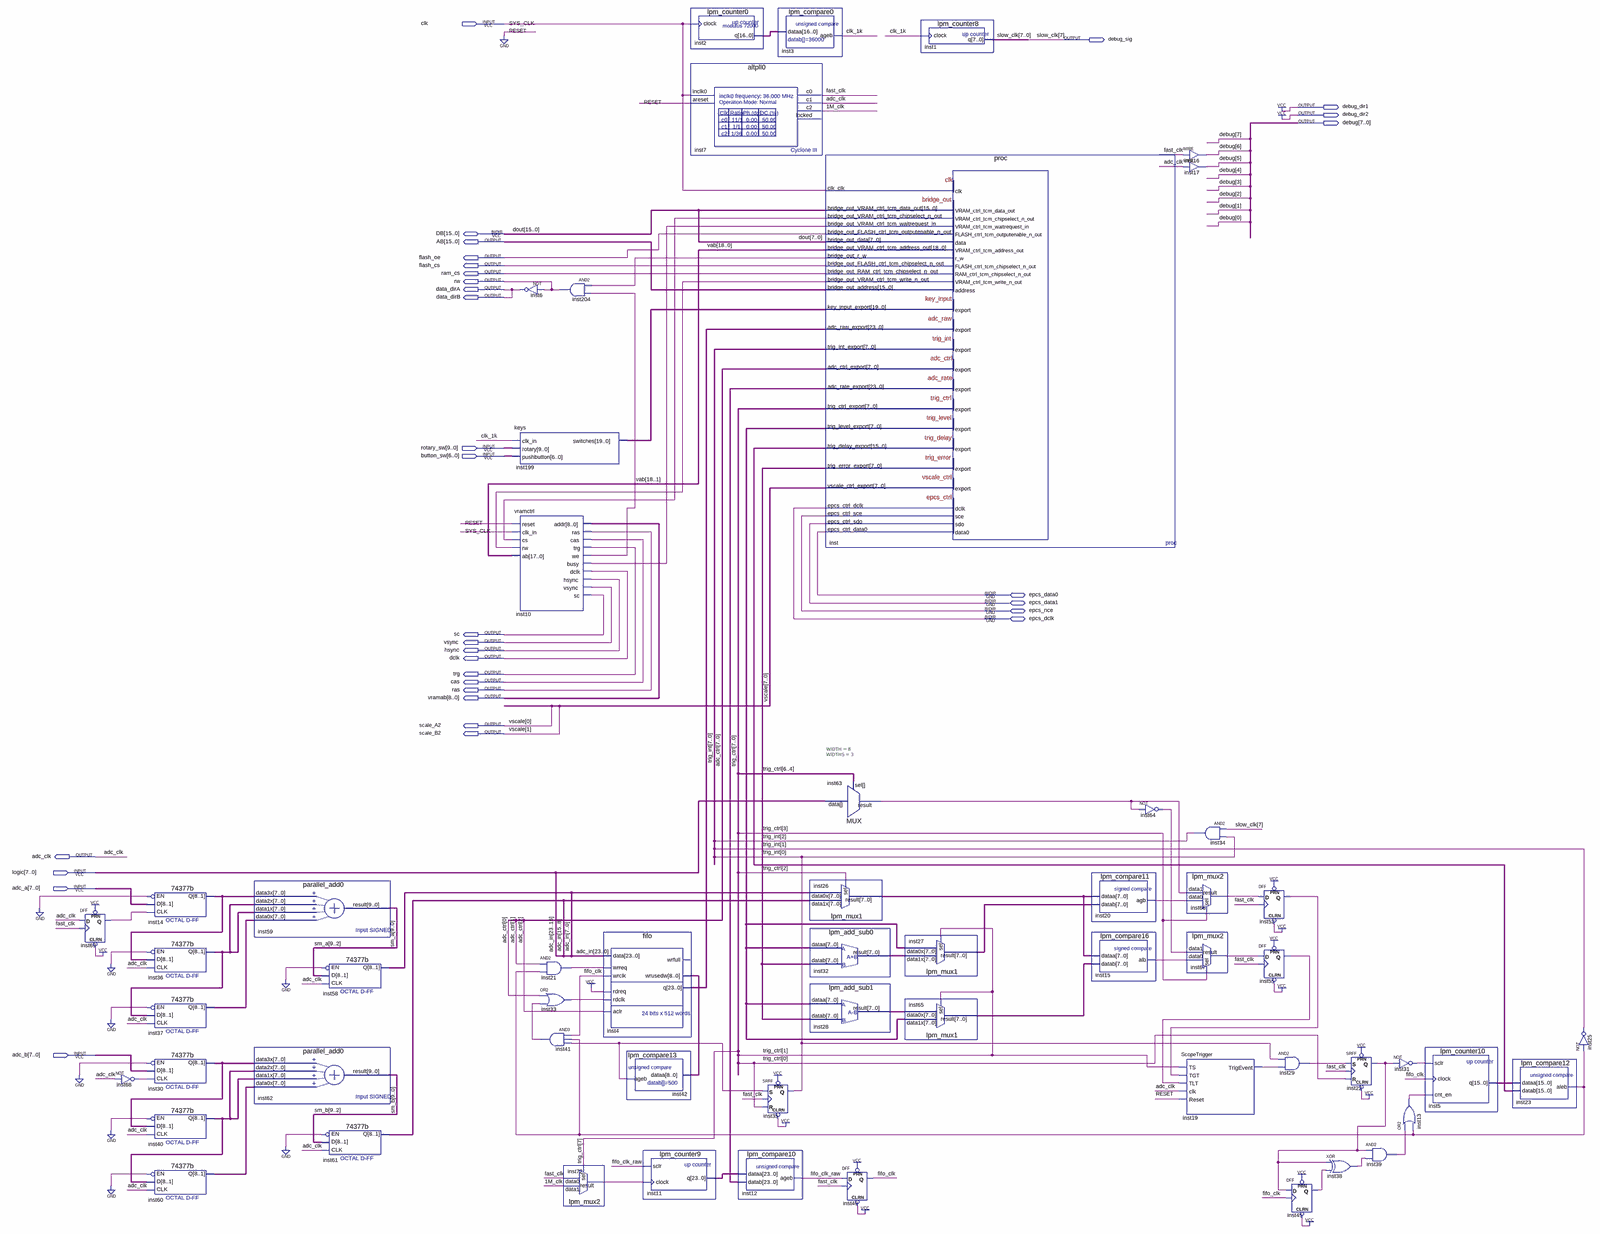
[diagram p0: schematic sheet, whole]
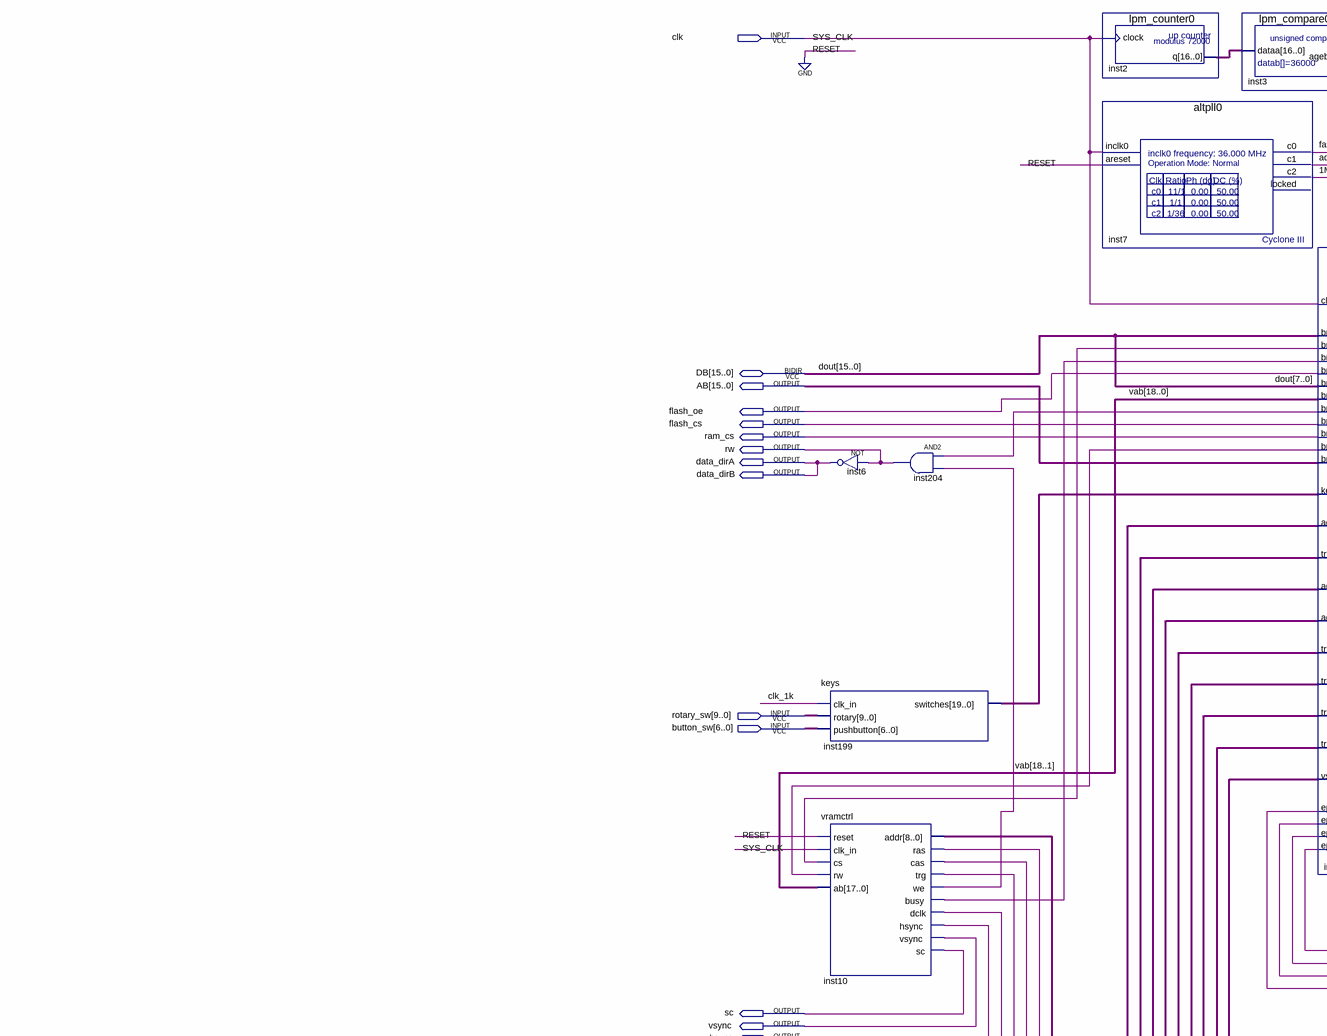
[diagram p1: schematic sheet, upper left part]
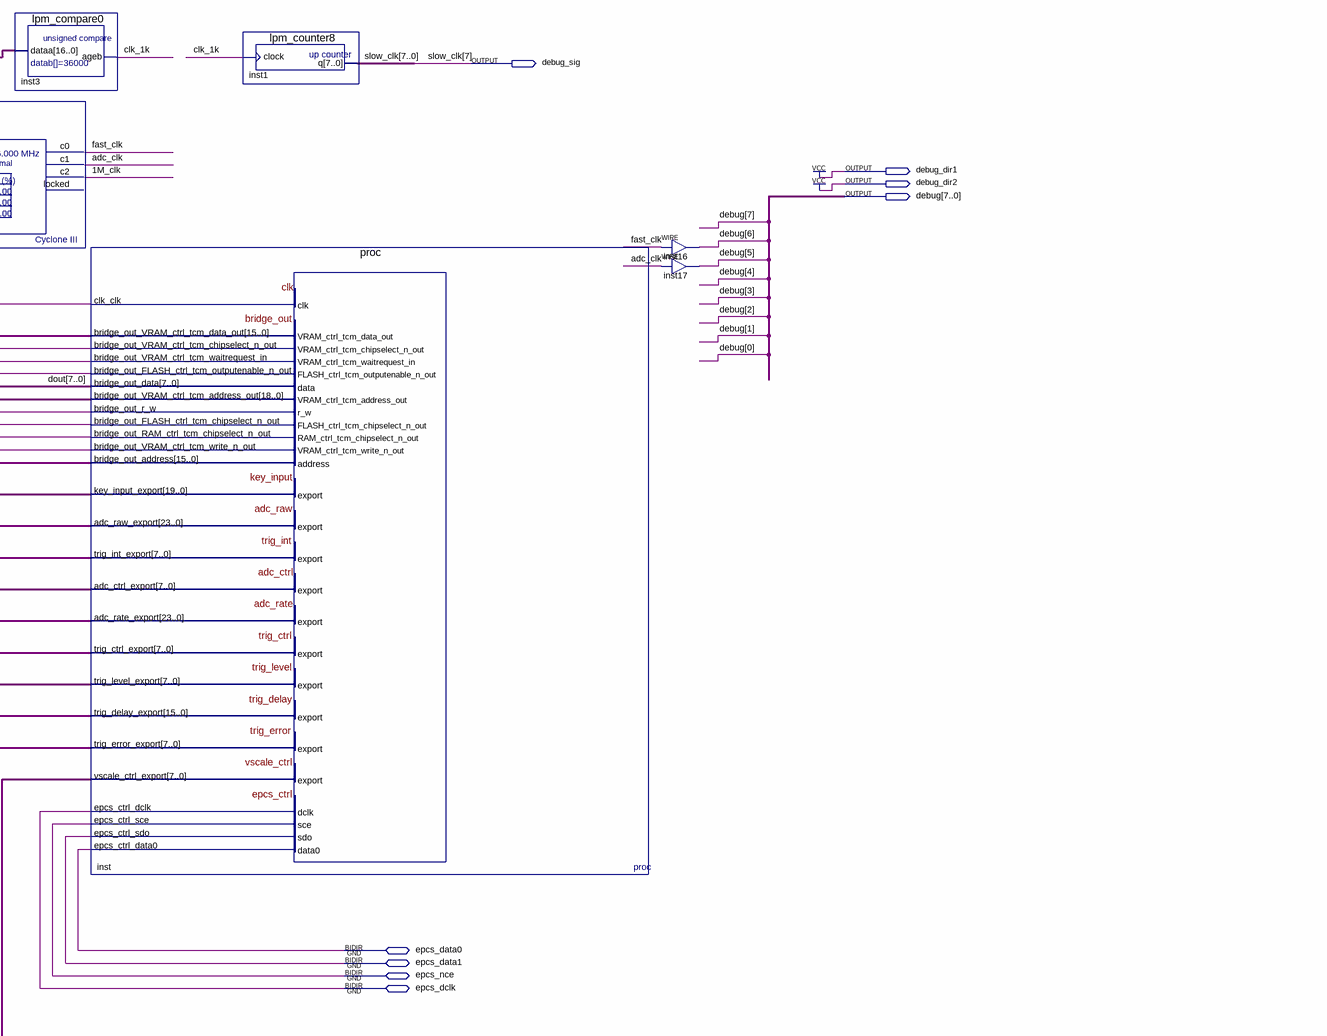
[diagram p2: schematic sheet, upper right part]
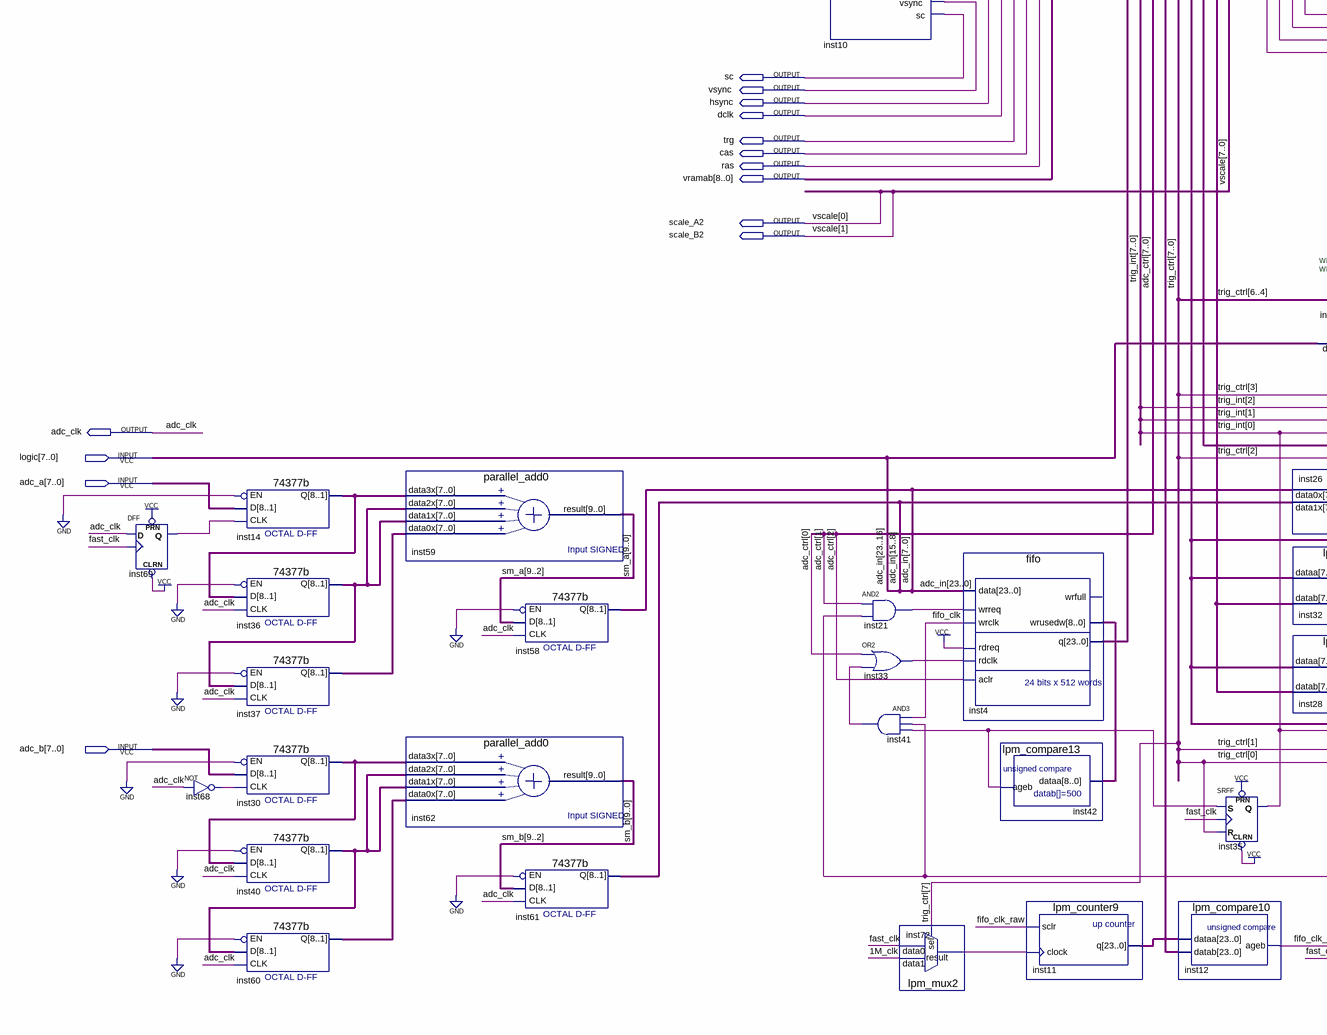
[diagram p3: schematic sheet, lower left part]
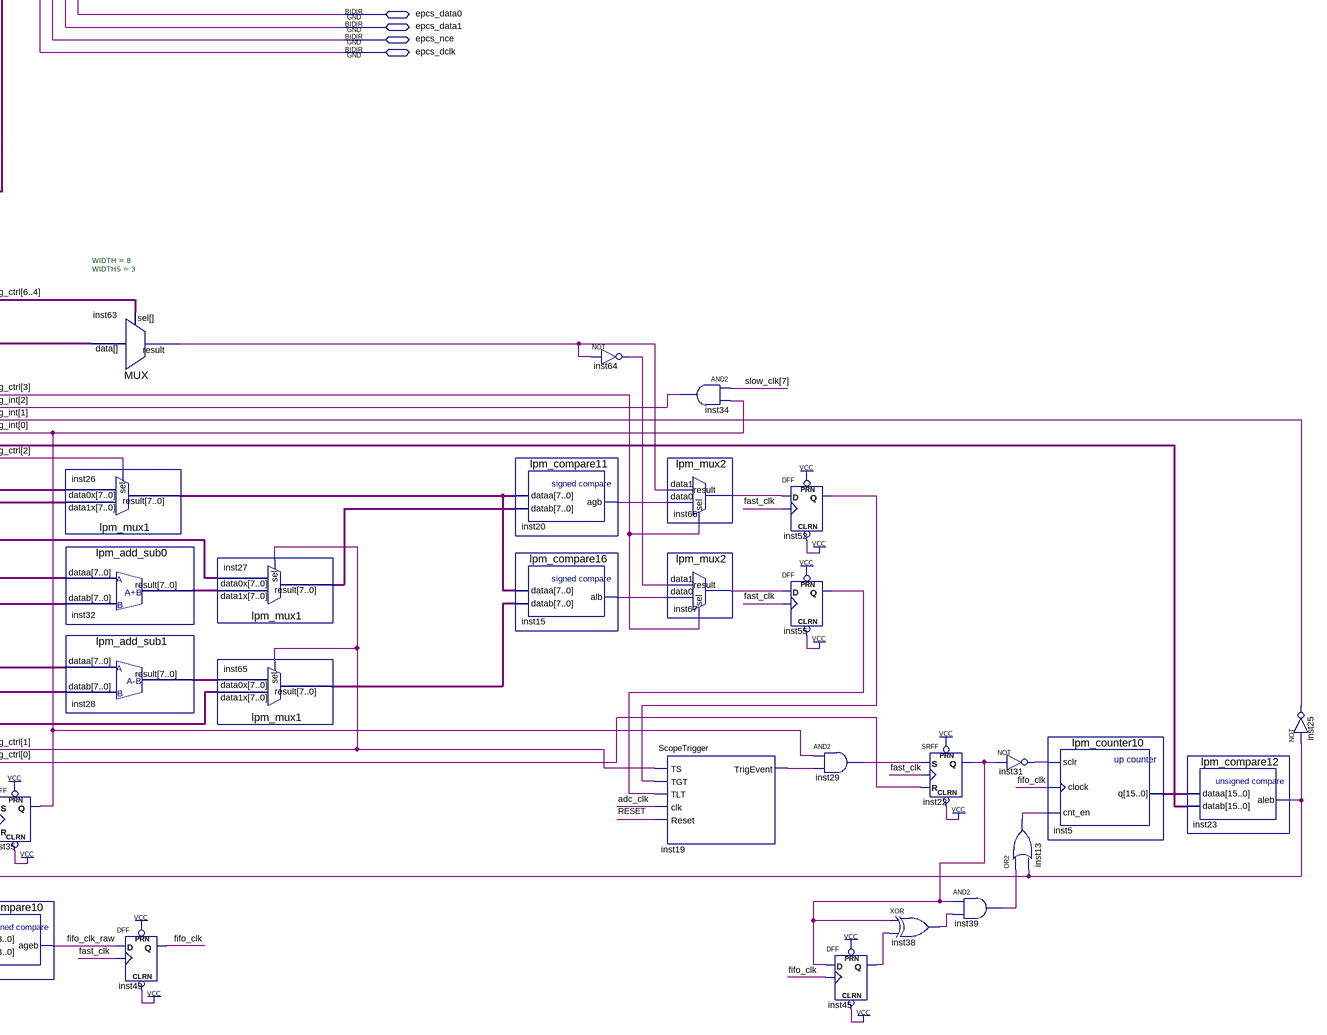
[diagram p4: schematic sheet, lower right part]
// Quartus schematic osc.bdf as structural Verilog: 58 symbols, 33 pins
module osc (
  input  clk,
  input  [9:0] rotary_sw,
  input  [6:0] button_sw,
  input  [7:0] \logic ,
  input  [7:0] adc_a,
  input  [7:0] adc_b,
  inout  [15:0] DB,
  inout  epcs_data0,
  inout  epcs_data1,
  inout  epcs_nce,
  inout  epcs_dclk,
  output debug_sig,
  output debug_dir1,
  output debug_dir2,
  output [7:0] debug,
  output [15:0] AB,
  output flash_oe,
  output flash_cs,
  output ram_cs,
  output rw,
  output data_dirA,
  output data_dirB,
  output sc,
  output vsync,
  output hsync,
  output dclk,
  output trg,
  output cas,
  output ras,
  output [8:0] vramab,
  output scale_A2,
  output scale_B2,
  output adc_clk
);

  wire \1M_clk , clk_1k, fast_clk, fifo_clk, fifo_clk_raw, inst10_busy, inst10_we, inst13_out, inst15_alb,
       inst19_trigevent, inst20_agb, inst21_out, inst22_q, inst23_aleb, inst29_out, inst31_out, inst33_out,
       inst38_out, inst39_out, inst41_out, inst42_ageb, inst45_q, inst52_q, inst55_q, inst63_result,
       inst64_out, inst66_result, inst67_result, inst68_out, inst69_q, inst72_result, inst_bridge_out_r_w,
       inst_bridge_out_vram_ctrl_tcm_chipselect_n_out, inst_bridge_out_vram_ctrl_tcm_write_n_out;
  wire [6:0] slow_clk;
  wire [7:0] adc_ctrl, inst14_q, inst26_result, inst27_result, inst28_result, inst30_q, inst32_result,
       inst36_q, inst37_q, inst40_q, inst60_q, inst65_result, inst_trig_error_export, inst_trig_level_export,
       trig_ctrl, trig_int;
  wire [7:2] vscale;
  wire [8:0] inst4_wrusedw;
  wire [9:0] sm_a, sm_b;
  wire [15:0] adc_in, inst5_q, inst_trig_delay_export;
  wire [16:0] inst2_q;
  wire [18:0] vab;
  wire [19:0] inst199_switches;
  wire [23:0] inst4_q, inst11_q, inst_adc_rate_export;

  DFF inst69 (.CLRN(1'b1), .CLK(fast_clk), .D(adc_clk), .PRN(1'b1), .Q(inst69_q));
  not inst68 (inst68_out, adc_clk);
  \74377b  inst14 (.CLK(inst69_q), .EN(1'b0), .D(adc_a), .Q(inst14_q));
  \74377b  inst36 (.CLK(adc_clk), .EN(1'b0), .D(inst14_q), .Q(inst36_q));
  \74377b  inst37 (.CLK(adc_clk), .EN(1'b0), .D(inst36_q), .Q(inst37_q));
  \74377b  inst30 (.CLK(inst68_out), .EN(1'b0), .D(adc_b), .Q(inst30_q));
  \74377b  inst40 (.CLK(adc_clk), .EN(1'b0), .D(inst30_q), .Q(inst40_q));
  \74377b  inst60 (.CLK(adc_clk), .EN(1'b0), .D(inst40_q), .Q(inst60_q));
  parallel_add0 inst59 (.data3x(inst14_q), .data2x(inst36_q), .data1x(inst36_q), .data0x(inst37_q), .result(sm_a));
  parallel_add0 inst62 (.data3x(inst30_q), .data2x(inst40_q), .data1x(inst40_q), .data0x(inst60_q), .result(sm_b));
  \74377b  inst58 (.CLK(adc_clk), .EN(1'b0), .D(sm_a[9:2]), .Q(adc_in[7:0]));
  \74377b  inst61 (.CLK(adc_clk), .EN(1'b0), .D(sm_b[9:2]), .Q(adc_in[15:8]));
  keys inst199 (.clk_in(clk_1k), .rotary(rotary_sw), .pushbutton(button_sw), .switches(inst199_switches));
  vramctrl inst10 (
    .reset(1'b0), .clk_in(clk), .cs(inst_bridge_out_vram_ctrl_tcm_chipselect_n_out),
    .rw(inst_bridge_out_vram_ctrl_tcm_write_n_out), .ab(vab[18:1]), .addr(vramab), .ras(ras), .cas(cas),
    .trg(trg), .we(inst10_we), .busy(inst10_busy), .dclk(dclk), .hsync(hsync), .vsync(vsync), .sc(sc));
  not inst6 (data_dirA, rw);
  and inst21 (inst21_out, adc_ctrl[1], inst23_aleb);
  or inst33 (inst33_out, adc_ctrl[0], inst41_out);
  and inst41 (inst41_out, fifo_clk, inst23_aleb, inst42_ageb);
  and inst204 (rw, inst_bridge_out_r_w, inst10_we);
  lpm_mux2 inst72 (.data1(\1M_clk ), .data0(fast_clk), .sel(trig_ctrl[7]), .result(inst72_result));
  fifo inst4 (
    .data({\logic , adc_in}), .wrreq(inst21_out), .wrclk(fifo_clk), .rdreq(1'b1), .rdclk(inst33_out),
    .aclr(adc_ctrl[2]), .wrusedw(inst4_wrusedw), .q(inst4_q));  // open: wrfull
  lpm_compare13 inst42 (.dataa(inst4_wrusedw), .ageb(inst42_ageb));
  lpm_counter9 inst11 (.sclr(fifo_clk_raw), .clock(inst72_result), .q(inst11_q));
  lpm_counter0 inst2 (.clock(clk), .q(inst2_q));
  altpll0 inst7 (.inclk0(clk), .areset(1'b0), .c0(fast_clk), .c1(adc_clk), .c2(\1M_clk ));  // open: locked
  lpm_compare10 inst12 (.dataa(inst11_q), .datab(inst_adc_rate_export), .ageb(fifo_clk_raw));
  SRFF inst35 (.PRN(1'b1), .CLRN(1'b1), .S(inst42_ageb), .R(trig_ctrl[0]), .CLK(fast_clk), .Q(trig_int[0]));
  lpm_compare0 inst3 (.dataa(inst2_q), .ageb(clk_1k));
  proc inst (
    .clk_clk(clk), .bridge_out_VRAM_ctrl_tcm_waitrequest_in(inst10_busy),
    .key_input_export(inst199_switches), .adc_raw_export(inst4_q), .trig_int_export(trig_int),
    .epcs_ctrl_data0(epcs_data0),
    .bridge_out_VRAM_ctrl_tcm_chipselect_n_out(inst_bridge_out_vram_ctrl_tcm_chipselect_n_out),
    .bridge_out_FLASH_ctrl_tcm_outputenable_n_out(flash_oe), .bridge_out_VRAM_ctrl_tcm_address_out(vab),
    .bridge_out_r_w(inst_bridge_out_r_w), .bridge_out_FLASH_ctrl_tcm_chipselect_n_out(flash_cs),
    .bridge_out_RAM_ctrl_tcm_chipselect_n_out(ram_cs),
    .bridge_out_VRAM_ctrl_tcm_write_n_out(inst_bridge_out_vram_ctrl_tcm_write_n_out),
    .bridge_out_address(AB), .adc_ctrl_export(adc_ctrl), .adc_rate_export(inst_adc_rate_export),
    .trig_ctrl_export(trig_ctrl), .trig_level_export(inst_trig_level_export),
    .trig_delay_export(inst_trig_delay_export), .trig_error_export(inst_trig_error_export),
    .vscale_ctrl_export({vscale, scale_B2, scale_A2}), .epcs_ctrl_dclk(epcs_dclk), .epcs_ctrl_sce(epcs_nce),
    .epcs_ctrl_sdo(epcs_data1), .bridge_out_VRAM_ctrl_tcm_data_out(DB), .bridge_out_data(DB[7:0]));
  MUX #(.WIDTH(8), .WIDTHS(3)) inst63 (.data(\logic ), .sel(trig_ctrl[6:4]), .result(inst63_result));
  lpm_mux1 inst26 (.data1x(adc_in[15:8]), .data0x(adc_in[7:0]), .sel(trig_ctrl[2]), .result(inst26_result));
  lpm_add_sub0 inst32 (.dataa(inst_trig_level_export), .datab(inst_trig_error_export), .result(inst32_result));
  lpm_add_sub1 inst28 (.dataa(inst_trig_level_export), .datab(inst_trig_error_export), .result(inst28_result));
  DFF inst49 (.CLRN(1'b1), .CLK(fast_clk), .D(fifo_clk_raw), .PRN(1'b1), .Q(fifo_clk));
  lpm_counter8 inst1 (.clock(clk_1k), .q({debug_sig, slow_clk}));
  lpm_mux1 inst27 (.data1x(inst32_result), .data0x(inst_trig_level_export), .sel(trig_ctrl[1]), .result(inst27_result));
  lpm_mux1 inst65 (.data1x(inst_trig_level_export), .data0x(inst28_result), .sel(trig_ctrl[1]), .result(inst65_result));
  lpm_compare11 inst20 (.dataa(inst26_result), .datab(inst27_result), .agb(inst20_agb));
  lpm_compare16 inst15 (.dataa(inst26_result), .datab(inst65_result), .alb(inst15_alb));
  not inst64 (inst64_out, inst63_result);
  assign debug[6] = fast_clk;  // WIRE inst16
  assign debug[5] = adc_clk;  // WIRE inst17
  ScopeTrigger inst19 (
    .TS(trig_ctrl[1]), .TGT(inst52_q), .TLT(inst55_q), .clk(adc_clk), .Reset(1'b0),
    .TrigEvent(inst19_trigevent));
  and inst34 (trig_int[2], debug_sig, trig_int[0]);
  lpm_mux2 inst66 (.data1(inst63_result), .data0(inst20_agb), .sel(trig_ctrl[3]), .result(inst66_result));
  lpm_mux2 inst67 (.data1(inst64_out), .data0(inst15_alb), .sel(trig_ctrl[3]), .result(inst67_result));
  DFF inst52 (.CLRN(1'b1), .CLK(fast_clk), .D(inst66_result), .PRN(1'b1), .Q(inst52_q));
  DFF inst55 (.CLRN(1'b1), .CLK(fast_clk), .D(inst67_result), .PRN(1'b1), .Q(inst55_q));
  and inst29 (inst29_out, trig_int[0], inst19_trigevent);
  DFF inst45 (.CLRN(1'b1), .CLK(fifo_clk), .D(inst22_q), .PRN(1'b1), .Q(inst45_q));
  xor inst38 (inst38_out, inst22_q, inst45_q);
  SRFF inst22 (.PRN(1'b1), .CLRN(1'b1), .S(inst29_out), .R(trig_ctrl[0]), .CLK(fast_clk), .Q(inst22_q));
  and inst39 (inst39_out, inst22_q, inst38_out);
  not inst31 (inst31_out, inst22_q);
  or inst13 (inst13_out, inst39_out, inst23_aleb);
  lpm_counter10 inst5 (.sclr(inst31_out), .clock(fifo_clk), .cnt_en(inst13_out), .q(inst5_q));
  lpm_compare12 inst23 (.dataa(inst5_q), .datab(inst_trig_delay_export), .aleb(inst23_aleb));
  not inst25 (trig_int[1], inst23_aleb);

  assign data_dirB = data_dirA;
  assign debug_dir1 = 1'b1;
  assign debug_dir2 = 1'b1;

  // Other names for the same wires on the sheet: adc_in[23:16] = \logic ; dout[15:0] = DB; slow_clk[7] = debug_sig;
  //   SYS_CLK = clk; vscale[1:0] = {scale_B2, scale_A2}
endmodule
